# EAGLE design RH008.1 (EAGLE 7.1.0)
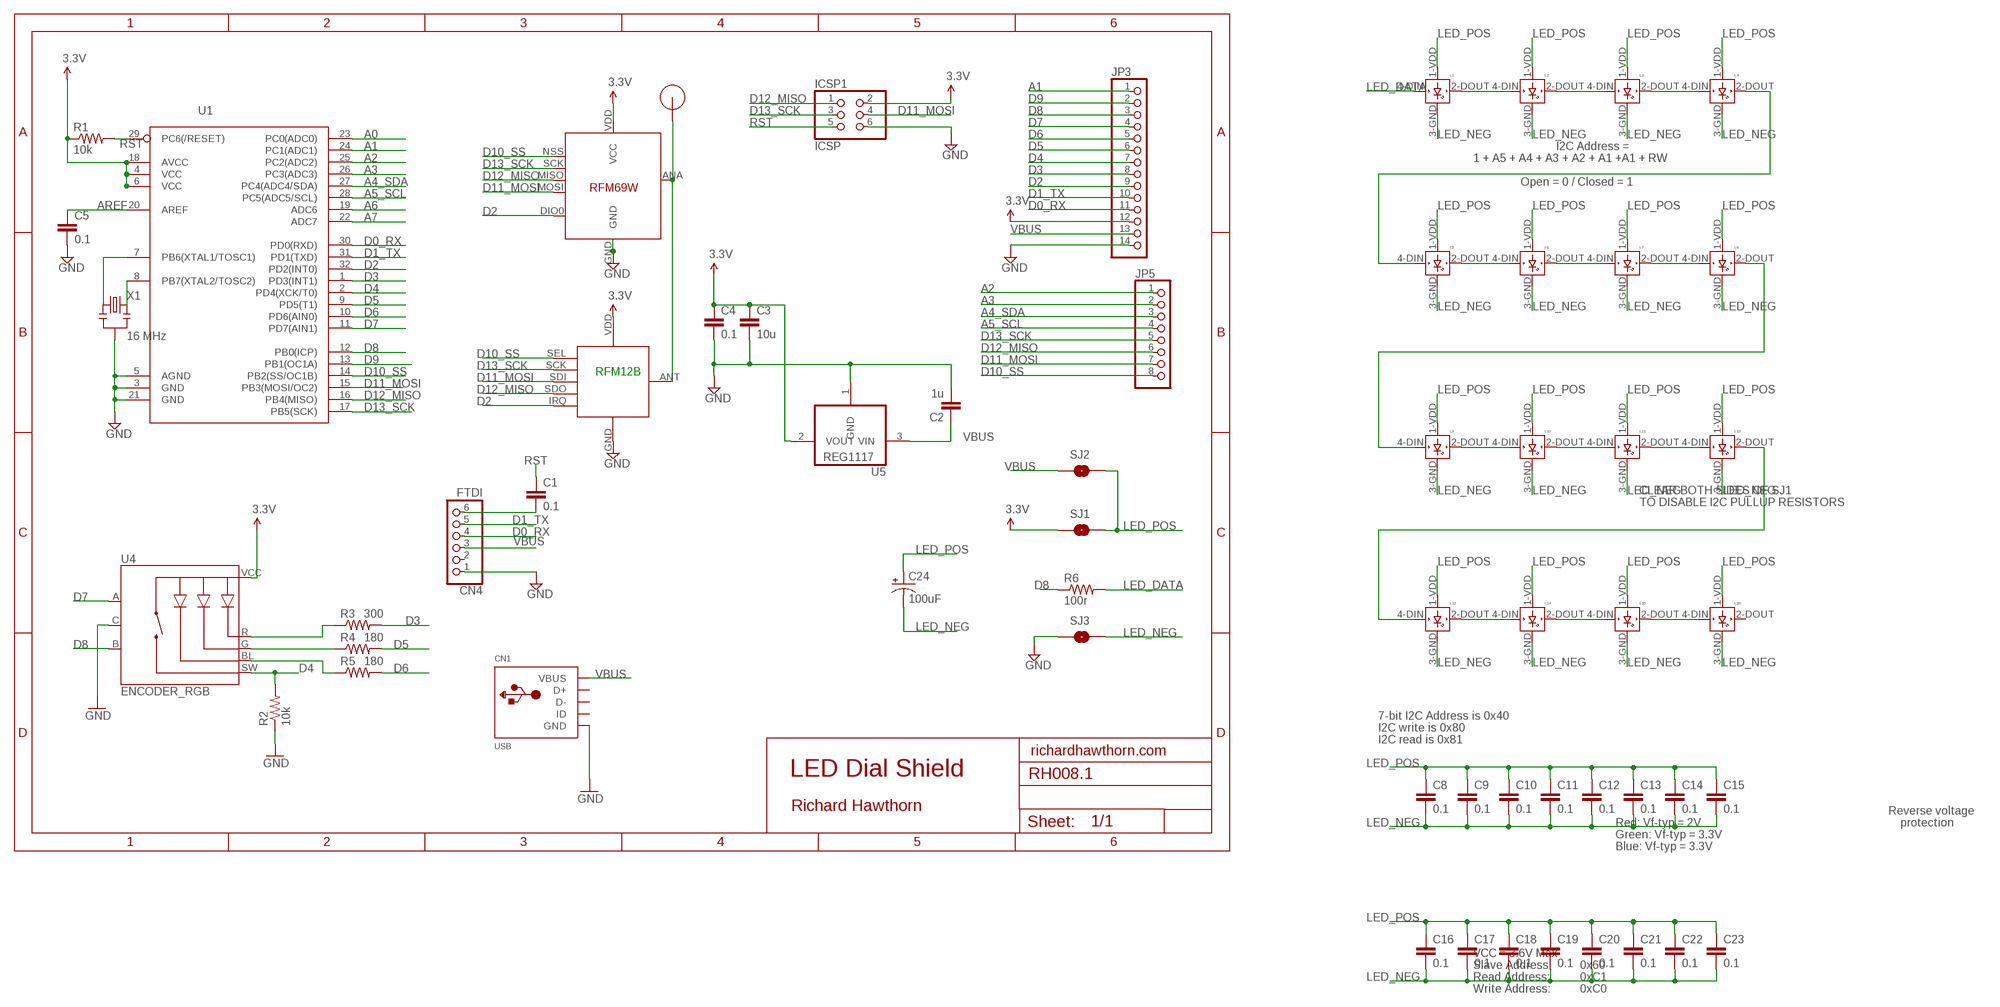
[diagram p0: schematic, sheet 1]

## Parts
C1  0.1  CAP0603-CAP  [0603-CAP]
C2  1u  CAP0603-CAP  [0603-CAP]
C3  10u  CAP0805-CAP  [0805-CAP]
C4  0.1  CAP0603-CAP  [0603-CAP]
C5  0.1  CAP0603-CAP  [0603-CAP]
C8  0.1  CAP0603-CAP  [0603-CAP]
C9  0.1  CAP0603-CAP  [0603-CAP]
C10  0.1  CAP0603-CAP  [0603-CAP]
C11  0.1  CAP0603-CAP  [0603-CAP]
C12  0.1  CAP0603-CAP  [0603-CAP]
C13  0.1  CAP0603-CAP  [0603-CAP]
C14  0.1  CAP0603-CAP  [0603-CAP]
C15  0.1  CAP0603-CAP  [0603-CAP]
C16  0.1  CAP0603-CAP  [0603-CAP]
C17  0.1  CAP0603-CAP  [0603-CAP]
C18  0.1  CAP0603-CAP  [0603-CAP]
C19  0.1  CAP0603-CAP  [0603-CAP]
C20  0.1  CAP0603-CAP  [0603-CAP]
C21  0.1  CAP0603-CAP  [0603-CAP]
C22  0.1  CAP0603-CAP  [0603-CAP]
C23  0.1  CAP0603-CAP  [0603-CAP]
C24  100uF  100UF-10V-10%(TANT)  [EIA7343]
CN1  USB  USBMINIB  [USB-MINIB]
CN4  FTDI  PINHD-1X6  [1X06]
ICSP1  ICSP  PINHD-2X3  [2X03]
JP3  PINHD-1X14  [1X14]
JP5  PINHD-1X8  [1X08]
L1  WS2812B  [WS2812B]
L2  WS2812B  [WS2812B]
L3  WS2812B  [WS2812B]
L4  WS2812B  [WS2812B]
L5  WS2812B  [WS2812B]
L6  WS2812B  [WS2812B]
L7  WS2812B  [WS2812B]
L8  WS2812B  [WS2812B]
L9  WS2812B  [WS2812B]
L10  WS2812B  [WS2812B]
L11  WS2812B  [WS2812B]
L12  WS2812B  [WS2812B]
L13  WS2812B  [WS2812B]
L14  WS2812B  [WS2812B]
L15  WS2812B  [WS2812B]
L16  WS2812B  [WS2812B]
R1  10k  R-US_R0805  [R0805]
R2  10k  R-US_R0805  [R0805]
R3  300  R-US_R0805  [R0805]
R4  180  R-US_R0805  [R0805]
R5  180  R-US_R0805  [R0805]
R6  100r  R-US_R0805  [R0805]
RF1  RFM12B  RFM12B_MINPADS  [RFM12B-MINPADS]
RF2  RFM69  [RFM69W-MINPADS]
SJ1  SOLDERJUMPERNO  [SJ_2S-NO]
SJ2  SOLDERJUMPERNO  [SJ_2S-NO]
SJ3  SOLDERJUMPERNO  [SJ_2S-NO]
U1  ATMega-328  ATMEGA168/328TQFP32  [TQFP32-08]
U4  ENCODER_RGB  [ENCODER_LED_RGB]
U5  REG1117  [SOT223]
U$1  RFM12B_ANTENNA  [RFM12B-ANTENNA]
X1  16 MHz  RESONATORSMD  [RESONATOR-SMD]

## Nets
3.3V: JP3.12
A0: U1.23(PC0(ADC0))
A1: JP3.1 U1.24(PC1(ADC1))
A2: JP5.1 U1.25(PC2(ADC2))
A3: JP5.2 U1.26(PC3(ADC3))
A4_SDA: JP5.3 U1.27(PC4(ADC4/SDA))
A5_SCL: JP5.4 U1.28(PC5(ADC5/SCL))
A6: U1.19(ADC6)
A7: U1.22(ADC7)
AREF: C5.1 U1.20(AREF)
D0_RX: CN4.4 JP3.11 U1.30(PD0(RXD))
D1_TX: CN4.5 JP3.10 U1.31(PD1(TXD))
D2: JP3.9 RF1.IRQ RF2.DIO0 U1.32(PD2(INT0))
D3: JP3.8 R3.2 U1.1(PD3(INT1))
D4: JP3.7 R2.2 U1.2(PD4(XCK/T0)) U4.SW
D5: JP3.6 R4.2 U1.9(PD5(T1))
D6: JP3.5 R5.2 U1.10(PD6(AIN0))
D7: JP3.4 U1.11(PD7(AIN1)) U4.A
D8: JP3.3 R6.1 U1.12(PB0(ICP)) U4.B
D9: JP3.2 U1.13(PB1(OC1A))
D10_SS: JP5.8 RF1.SEL RF2.NSS(SEL) U1.14(PB2(SS/OC1B))
D11_MOSI: ICSP1.4 JP5.7 RF1.SDI(SDI/MOSI) RF2.MOSI U1.15(PB3(MOSI/OC2))
D12_MISO: ICSP1.1 JP5.6 RF1.SDO(SDO/MISO) RF2.MISO U1.16(PB4(MISO))
D13_SCK: ICSP1.3 JP5.5 RF1.SCK RF2.SCK U1.17(PB5(SCK))
GND [power]: C2.2 C3.2 C4.2 C5.2 CN1.GND CN4.1 ICSP1.6 JP3.14 R2.1 RF1.GND RF2.GND SJ3.1 U1.3(GND) U1.5(AGND) U1.21(GND) U4.C U5.1(GND) X1.2
LED-B: R5.1 U4.BL
LED-G: R4.1 U4.G
LED-MID-1: L5.2-DOUT(DOUT) L6.4-DIN(DIN)
LED-MID-2: L7.2-DOUT(DOUT) L8.4-DIN(DIN)
LED-MID-3: L9.2-DOUT(DOUT) L10.4-DIN(DIN)
LED-OUT-1: L1.2-DOUT(DOUT) L2.4-DIN(DIN)
LED-OUT-2: L3.2-DOUT(DOUT) L4.4-DIN(DIN)
LED-OUT-3: L4.2-DOUT(DOUT) L5.4-DIN(DIN)
LED-OUT-4: L12.2-DOUT(DOUT) L13.4-DIN(DIN)
LED-OUT-5: L13.2-DOUT(DOUT) L14.4-DIN(DIN)
LED-OUT-6: L15.2-DOUT(DOUT) L16.4-DIN(DIN)
LED-R: R3.1 U4.R
LED_DATA: L1.4-DIN(DIN) R6.2
LED_NEG [power]: C8.2 C9.2 C10.2 C11.2 C12.2 C13.2 C14.2 C15.2 C16.2 C17.2 C18.2 C19.2 C20.2 C21.2 C22.2 C23.2 C24.C(-) L1.3-GND(GND) L2.3-GND(GND) L3.3-GND(GND) L4.3-GND(GND) L5.3-GND(GND) L6.3-GND(GND) L7.3-GND(GND) L8.3-GND(GND) L9.3-GND(GND) L10.3-GND(GND) L11.3-GND(GND) L12.3-GND(GND) L13.3-GND(GND) L14.3-GND(GND) L15.3-GND(GND) L16.3-GND(GND) SJ3.2
LED_POS [power]: C8.1 C9.1 C10.1 C11.1 C12.1 C13.1 C14.1 C15.1 C16.1 C17.1 C18.1 C19.1 C20.1 C21.1 C22.1 C23.1 C24.A(+) L1.1-VDD(VDD) L2.1-VDD(VDD) L3.1-VDD(VDD) L4.1-VDD(VDD) L5.1-VDD(VDD) L6.1-VDD(VDD) L7.1-VDD(VDD) L8.1-VDD(VDD) L9.1-VDD(VDD) L10.1-VDD(VDD) L11.1-VDD(VDD) L12.1-VDD(VDD) L13.1-VDD(VDD) L14.1-VDD(VDD) L15.1-VDD(VDD) L16.1-VDD(VDD) SJ1.2 SJ2.2
N$1: L2.2-DOUT(DOUT) L3.4-DIN(DIN)
N$2: L6.2-DOUT(DOUT) L7.4-DIN(DIN)
N$3: L8.2-DOUT(DOUT) L9.4-DIN(DIN)
N$4: L10.2-DOUT(DOUT) L11.4-DIN(DIN)
N$5: L11.2-DOUT(DOUT) L12.4-DIN(DIN)
N$6: U1.7(PB6(XTAL1/TOSC1)) X1.1
N$8: RF1.ANT RF2.ANA(ANT) U$1.P$1
N$18: L14.2-DOUT(DOUT) L15.4-DIN(DIN)
N$20: C1.2 CN4.6
N$21: U1.8(PB7(XTAL2/TOSC2)) X1.3
RST: C1.1 ICSP1.5 R1.2 U1.29(PC6(/RESET))
VBUS [power]: C2.1 CN1.VBUS CN4.3 JP3.13 SJ2.1 U5.3(VIN)
VCC: C3.1 C4.1 ICSP1.2 R1.1 RF1.VDD RF2.VDD(VCC) SJ1.1 U1.4(VCC) U1.6(VCC) U1.18(AVCC) U4.VCC U5.2(VOUT) ; supply symbol labelled 3.3V
Unconnected: CN1.D+ CN1.D- CN1.ID CN4.2 L16.2-DOUT(DOUT)

## Notes on the sheet
- I2C Address =
- 1 + A5 + A4 + A3 + A2 + A1 +A1 + RW
- Open = 0 / Closed = 1
- RFM12B
- CLEAR BOTH SIDES OF SJ1
- TO DISABLE I2C PULLUP RESISTORS
- 7-bit I2C Address is 0x40
- I2C write is 0x80
- I2C read is 0x81
- richardhawthorn.com
- LED Dial Shield
- Richard Hawthorn
- Reverse voltage
- Red: Vf-typ = 2V | protection
- Green: Vf-typ = 3.3V
- Blue: Vf-typ = 3.3V
- VCC = 3.6V Max
- Slave Address: | 0x60
- Read Address: | 0xC1
- Write Address: | 0xC0

## Library data of the parts
C1-C5 C8-C23 = LowPowerLab:CAP: Capacitor Standard 0603 ceramic capacitor, and 0.1" leaded capacitor.
C24 = SparkFun-Capacitors:100UF-10V-10%(TANT): CAP-07890; PROD_ID: CAP-07890
CN1 = LowPowerLab:USB: USB Connectors USBMINIB - Surface Mount Female Mini-B USB Connector 4UConnector: 06564 By microbuilder.eu Thru-hole RA Female Mini-B USB Connector 4UConnector: 18732 By ladyada.net
CN4 = pinhead:PINHD-1X6: PIN HEADER
ICSP1 = pinhead:PINHD-2X3: PIN HEADER
JP3 = pinhead:PINHD-1X14: PIN HEADER
JP5 = pinhead:PINHD-1X8: PIN HEADER
L1-L16 = adafruit:WS2812B
R1-R6 = resistor:R-US_: RESISTOR, American symbol
RF1 = LowPowerLab:RFM12B_MINPADS
RF2 = LowPowerLab:RFM69
SJ1-SJ3 = SparkFun-Retired:SOLDERJUMPER: Solder Jumper Standard SMD solder jumper. Used to automate production. Two varients : Normally Open and Normally Closed are the same, but have different paste layers. NC will have a large amount of paste and should jumper during reflow.
U1 = LowPowerLab:ATMEGA168/328: Atmel 32-pin 8-bit micro, 16k flash.
U4 = SparkFun:ENCODER_RGB: Illuminated Rotary Encoder w/ RGB LED and select switch EC12PLRGBSDVBF-D: http://top-up.so-buy.com/front/bin/ptdetail.phtml?Part=EC12PLRGBSDVBF-D
U5 = burr-brown:REG1117: 800mA and 1A Low Dropout (LDO) Positive Regulator 1.8V, 2.5V, 2.85V, 3.3V, 5V, and Adj; MPN: REG1117; OC_FARNELL: 1097566; OC_NEWARK: 14P6981
U$1 = LowPowerLab:RFM12B_ANTENNA
X1 = SparkFun:RESONATOR: Resonator Small SMD resonator. This is the itty bitty 10/20MHz resonators with built in caps. CSTCE10M0G55 and CSTCE20M0V53. Footprint has been reviewed closely but hasn't been tested yet.

## Net classes
1 power: width 0.381 mm, clearance 0.254 mm

## Board
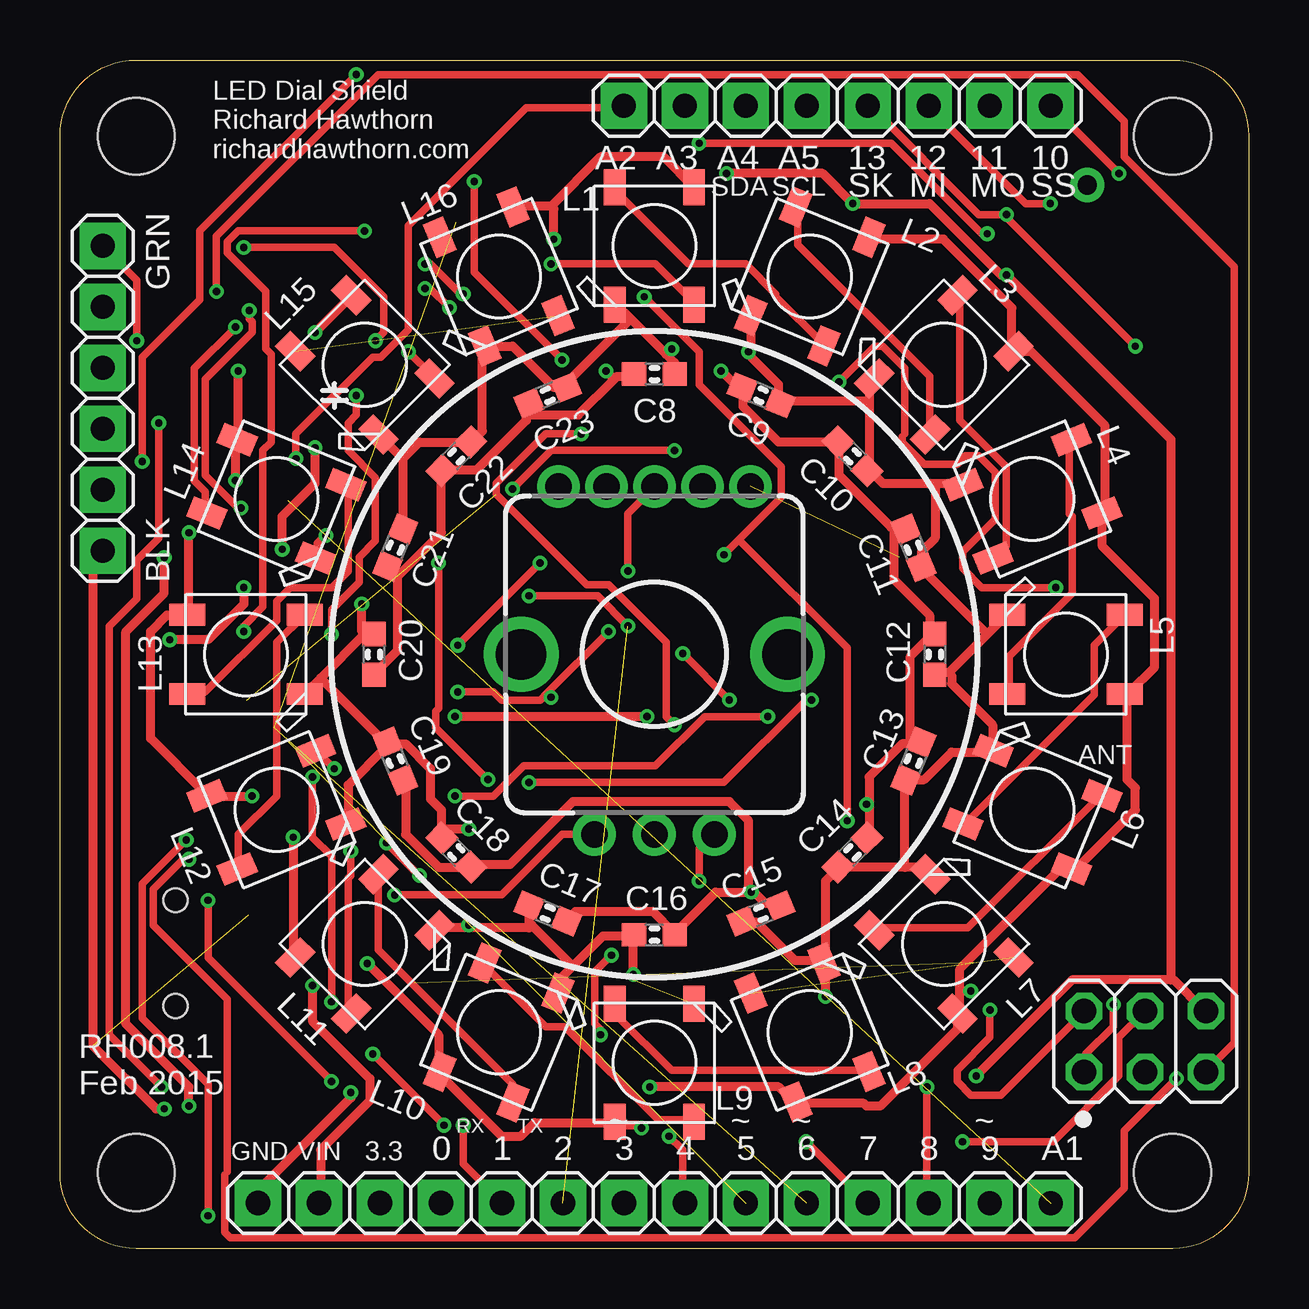
[diagram p1: board, top side]
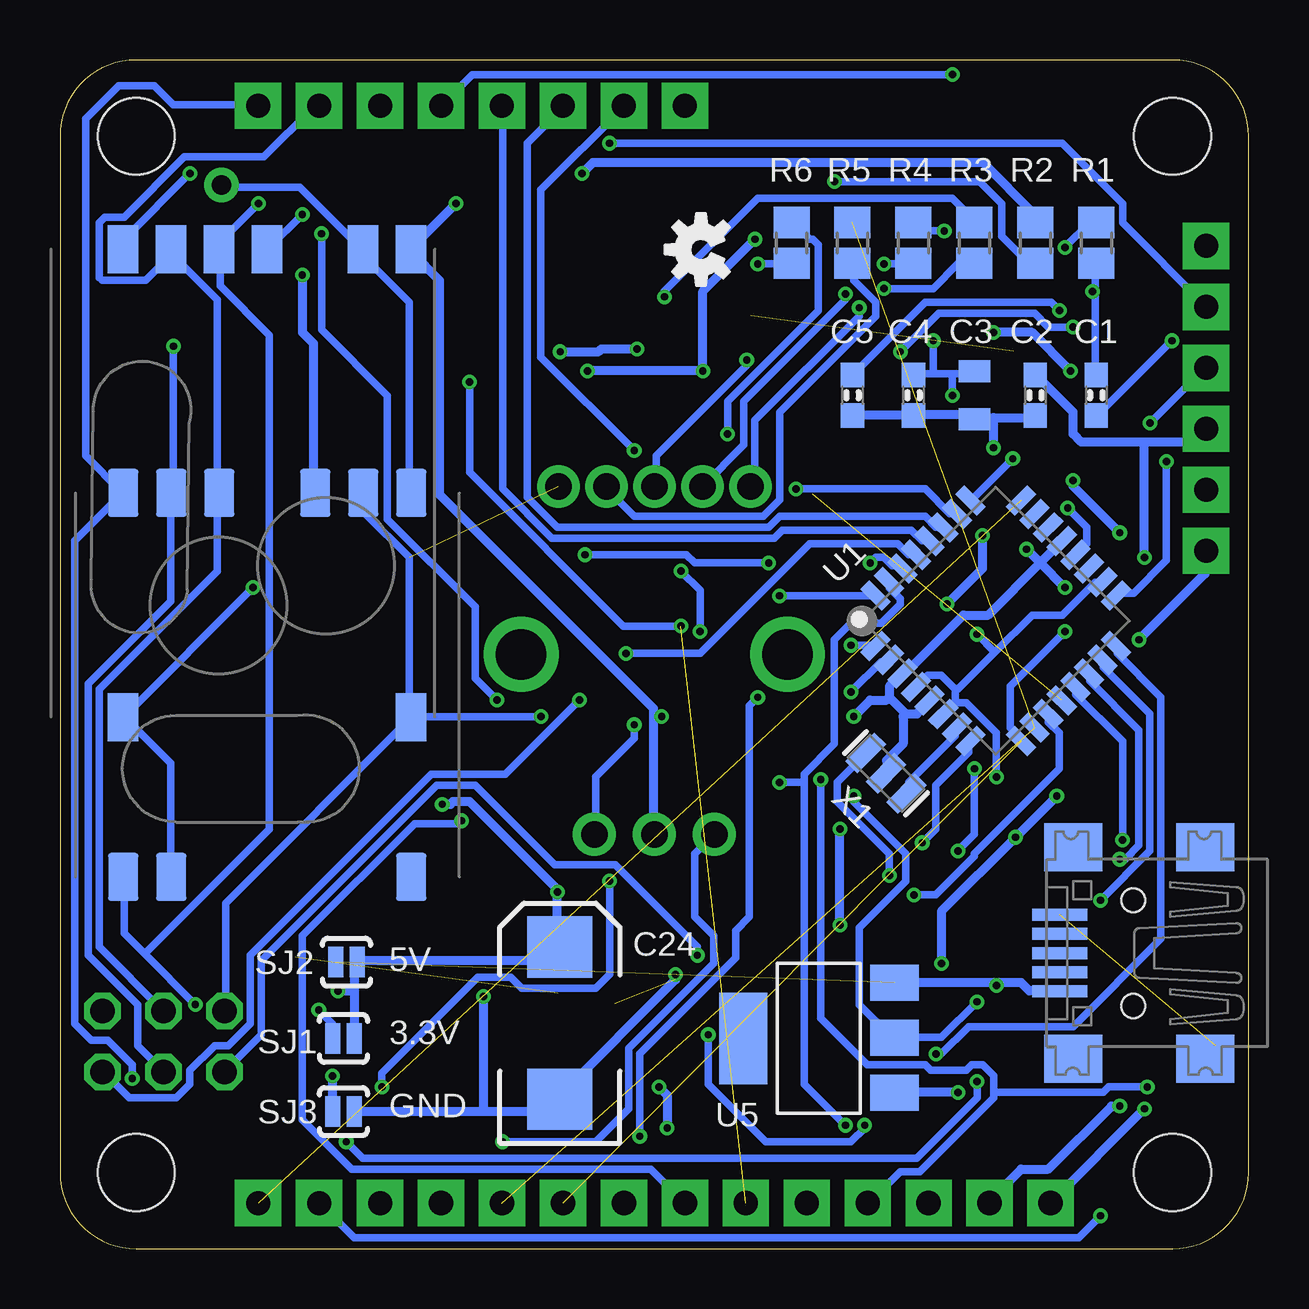
[diagram p2: board, bottom side, seen from below]

Size 49.53 x 49.53 mm. Coordinates in mm from the lower left corner, seen from the top.
Outline: 0,3.17 0,46.35 arc-90 3.17,49.53 46.35,49.53 arc-90 49.53,46.35 49.53,3.17 arc-90 46.35,0 3.17,0 arc-90 0,3.17
Copper layers (1*16): Top 0.035mm / dielectric 1.5mm / Bottom 0.035mm
Design rules "ITEADstudio_DRC *": minimum track width 12mil, minimum drill 12mil, track to track 6mil, track to pad 6mil, pad to pad 6mil, via to via 6mil, smd to smd 0mil, copper to edge 10mil, drill to drill 10mil, minimum pad ring 10mil, minimum via ring 6mil, stop-mask expansion 2mil, vias tented up to drill 100mil, thermal gap 15mil
Holes 3.2 mm at 3.17,3.17 46.35,3.17 3.17,46.35 46.35,46.35
tKeepout: area 0,0 to 5.7,5.7; area 43.8,0 to 49.5,5.7; area 43.8,43.8 to 49.5,49.5; area 0,43.8 to 5.7,49.5
bKeepout: area 0,43.8 to 5.7,49.5; area 43.8,43.8 to 49.5,49.5; area 43.8,0 to 49.5,5.7; area 0,0 to 5.7,5.7
tRestrict: area 24.3,8.9 to 29.1,12.8; area 5.8,16.9 to 6.9,18.5; area 5.2,9.7 to 6.7,10.4
bRestrict: area 27.4,17.7 to 29.2,18.7; area 21.1,13.8 to 22.9,14.9; area 21.6,12.6 to 22.1,13.2; area 20.7,12.6 to 21.2,13.2; area 20.2,12.8 to 20.7,13.5; area 20.1,13.4 to 20.6,14; area 26.5,18.9 to 27.1,19.5; area 26.5,17.9 to 27.1,18.5; area 27.5,19.1 to 28,19.8; area 27.9,18.8 to 29.1,19.6

### Footprints (pad centres in the part's own frame; a part is rotated, then mirrored left to right if it is on the bottom)
0603-CAP = smd 1.016 x 0.965: 1 -0.85,0; 2 0.85,0
0805-CAP = smd 0.902 x 1.3: 1 -1,0; 2 1,0
EIA7343 = smd 2.55 x 2.7: A 3.17,0; C -3.17,0
USB-MINIB = smd 0.5 x 2.308: D+ 0,4.064; D- -0.8,4.064; GND 1.6,4.064; ID 0.8,4.064; VBUS -1.6,4.064 | smd 2 x 2.4: GND1 -4.4,-2; GND2 -4.4,3.5; GND3 4.4,3.5; GND4 4.4,-2 | hole 1: -2.2,1; 2.2,1
1X06 = drill 1 pad 1.93 square: 1 -6.35,0; 2 -3.81,0; 3 -1.27,0; 4 1.27,0; 5 3.81,0; 6 6.35,0
2X03 = drill 1.016 octagon: 1 -2.54,-1.27; 2 -2.54,1.27; 3 0,-1.27; 4 0,1.27; 5 2.54,-1.27; 6 2.54,1.27
1X14 = drill 1 pad 1.93 square: 1 -16.51,0; 2 -13.97,0; 3 -11.43,0 | drill 1.016 pad 1.93 square: 4 -8.89,0; 5 -6.35,0; 6 -3.81,0; 7 -1.27,0; 8 1.27,0; 9 3.81,0; 10 6.35,0; 11 8.89,0; 12 11.43,0; 13 13.97,0; 14 16.51,0
1X08 = drill 1 pad 1.93 square: 1 -8.89,0; 2 -6.35,0; 3 -3.81,0; 4 -1.27,0; 5 1.27,0; 6 3.81,0; 7 6.35,0; 8 8.89,0
WS2812B = smd 1.5 x 0.9: 1-VDD 2.45,-1.65; 2-DOUT 2.45,1.65; 3-GND -2.45,1.65; 4-DIN -2.45,-1.65
R0805 = smd 1.3 x 1.5: 1 -0.85,0; 2 0.85,0
RFM12B-MINPADS = smd 2 x 1.27: ANT 8,-6; GND 8,-2; IRQ -8,4; SCK 8,4; SDI 8,2; SDI1 -8.002,-6.001; SDO -8,6; SEL 8,6; VDD 8,-4
RFM69W-MINPADS = smd 2 x 1.27: ANA 8,-5; DIO0 -11.5,5; GND 8,-7; MISO 8,1; MOSI 8,3; NSS 8,5; SCK 8,-1; VDD -11.5,-7
SJ_2S-NO = smd 0.635 x 1.27: 1 -0.45,0; 2 0.45,0
TQFP32-08 = smd 1.27 x 0.533: 1 -4.293,2.8; 2 -4.293,2; 3 -4.293,1.2; 4 -4.293,0.4; 5 -4.293,-0.4; 6 -4.293,-1.2; 7 -4.293,-2; 8 -4.293,-2.8; 17 4.293,-2.8; 18 4.293,-2; 19 4.293,-1.2; 20 4.293,-0.4; 21 4.293,0.4; 22 4.293,1.2; 23 4.293,2; 24 4.293,2.8 | smd 0.533 x 1.27: 9 -2.8,-4.293; 10 -2,-4.293; 11 -1.2,-4.293; 12 -0.4,-4.293; 13 0.4,-4.293; 14 1.2,-4.293; 15 2,-4.293; 16 2.8,-4.293; 25 2.8,4.293; 26 2,4.293; 27 1.2,4.293; 28 0.4,4.293; 29 -0.4,4.293; 30 -1.2,4.293; 31 -2,4.293; 32 -2.8,4.293
ENCODER_LED_RGB = drill 1.1 pad 1.8: A -2.5,-7.5; B 2.5,-7.5; C 0,-7.5 | drill 1.1 pad 1.778: BL 2,7; G -2,7; R -4,7; SW 0,7; VCC 4,7 | drill 2.1: P$1 -5.55,0; P$2 5.55,0
SOT223 = smd 1.499 x 2.007: 1 -2.261,-3.15; 2 0.025,-3.15; 3 2.311,-3.15 | smd 3.81 x 2.007: 4 0,3.15
RFM12B-ANTENNA = drill 0.8 pad 1.422: P$1 0,0
RESONATOR-SMD = smd 0.7 x 1.7: 1 -1.2,0; 2 0,0; 3 1.2,0

### Placement (x,y rotation side)
C1  6.35,35.56 270 bottom
C2  8.89,35.56 270 bottom
C3  11.43,35.56 270 bottom
C4  13.97,35.56 270 bottom
C5  16.51,35.56 270 bottom
C8  24.77,36.45 0 top
C9  29.21,35.56 337.5 top
C10  33.02,33.02 315 top
C11  35.56,29.21 292.5 top
C12  36.45,24.77 270 top
C13  35.56,20.32 247.5 top
C14  33.02,16.51 225 top
C15  29.21,13.97 202.5 top
C16  24.77,13.08 180 top
C17  20.32,13.97 157.5 top
C18  16.51,16.51 135 top
C19  13.97,20.32 112.5 top
C20  13.08,24.77 90 top
C21  13.97,29.21 67.5 top
C22  16.51,33.02 45 top
C23  20.32,35.56 22.5 top
C24  28.7,9.4 90 bottom
CN1  3.81,12.32 90 bottom
CN4  1.78,35.43 90 top
ICSP1  45.21,8.64 0 top
JP3  24.77,1.91 180 top
JP5  32.38,47.62 0 top
L1  24.77,41.78 90 top
L2  31.24,40.51 67.5 top
L3  36.83,36.83 45 top
L4  40.51,31.24 22.5 top
L5  41.91,24.77 0 top
L6  40.51,18.29 337.5 top
L7  36.83,12.7 315 top
L8  31.24,9.02 292.5 top
L9  24.77,7.75 270 top
L10  18.29,9.02 247.5 top
L11  12.7,12.7 225 top
L12  9.02,18.29 202.5 top
L13  7.75,24.77 180 top
L14  9.02,31.24 157.5 top
L15  12.7,36.83 135 top
L16  18.29,40.51 112.5 top
R1  6.35,41.91 270 bottom
R2  8.89,41.91 270 bottom
R3  11.43,41.91 90 bottom
R4  13.97,41.91 90 bottom
R5  16.51,41.91 90 bottom
R6  19.05,41.91 270 bottom
RF1  40.89,23.5 90 bottom
RF2  41.91,33.66 90 bottom
SJ1  37.72,8.76 0 bottom
SJ2  37.59,11.94 0 bottom
SJ3  37.72,5.71 0 bottom
U1  10.54,26.16 45 bottom
U4  24.77,24.77 0 top
U5  17.91,8.76 90 bottom
U$1  42.8,44.32 0 top
U$3  [OSHW-LOGO-S]  22.82,41.63 90 bottom
X1  15.11,19.81 135 bottom

### Tracks (layer width: path | path; a pad name or v marks a point on that pad's centre or on a via)
A1  (1 unrouted)
A2  (via drill 0.3)
  Top 0.305: v9.83,32.92 9.83,33.95 13.03,37.15 13.37,37.15 14.52,38.29 14.52,42.63 19.43,47.55 23.43,47.55 JP5.1
  Bottom 0.305: v9.83,32.92 11.54,31.2 U1.25
A3  (via drill 0.3)
  Top 0.305: v18.86,31.66 20.46,33.26 v25.6,33.26
  Bottom 0.305: v18.86,31.66 13.49,31.66 12.46,30.63 12.23,30.63 U1.26 | v25.6,33.26 29.49,37.15 29.49,44.12 26.06,47.55 JP5.2
A4_SDA
  Bottom 0.305: U1.27 12.8,30.06 13.03,30.06 13.49,30.52 19.55,30.52 20,30.06 28.8,30.06 30.06,31.32 30.06,46.06 28.57,47.55 JP5.3
A5_SCL
  Bottom 0.305: U1.28 13.37,29.49 13.6,29.49 14.06,29.95 19.43,29.95 19.77,29.6 29.03,29.6 31.09,31.66 31.09,47.55 JP5.4
AREF  (via drill 0.3)
  Top 0.305: v7.89,39.09 7.89,38.75 8,38.63 8,38.18 6.06,36.23 6.06,32.23 7.43,30.86 v7.54,30.86
  Bottom 0.305: v7.89,39.09 8.23,39.43 13.49,39.43 16.46,36.46 C5.1 | v7.54,30.86 6.74,30.06 6.74,29.38 7.2,28.92 U1.20
D0_RX  (via drill 0.3)
  Top 0.305: v15.77,28.57 15.77,22.52 15.66,22.4 15.66,21.72 v17.83,19.55 | v4.12,34.4 4.12,29.6 3.2,28.69 3.2,27.09 2.06,25.95 2.06,8.91 v4.23,6.74
  Bottom 0.305: v15.77,28.57 15.54,28.8 15.2,28.8 14.86,28.46 14.52,28.46 U1.30 | v17.83,19.55 17.83,9.6 15.89,7.66 13.49,7.66 13.26,7.43 11.77,7.43 11.54,7.66 11.09,7.66 10.63,7.2 10.63,6.51 | 10.63,6.51 10.63,6.29 13.72,3.2 14.52,3.2 15.77,1.94 JP3.11 | v4.12,34.4 1.83,36.69 CN4.4 | v4.23,6.74 5.83,6.74 6.06,6.51 10.63,6.51
D1_TX  (via drill 0.3)
  Top 0.305: v16.8,5.14 16.8,3.54 18.4,1.94 JP3.10 | v26.63,46.06 34.63,46.06 38.41,42.29 v38.63,42.29 | v31.32,22.86 31.09,22.86 27.66,19.43 v19.55,19.43
  Bottom 0.305: 18.52,19.43 18.52,6.86 v16.8,5.14 | 18.52,19.43 18.52,19.77 17.26,21.03 17.26,25.38 16.57,26.06 15.32,26.06 14.52,26.86 14.52,27.09 14.97,27.55 14.97,27.77 U1.31 | v26.63,46.06 7.77,46.06 5.26,43.55 5.26,42.75 1.83,39.32 CN4.5 | v38.63,42.29 38.63,38.29 35.89,35.55 35.89,30.4 32.23,26.75 32.23,23.77 v31.32,22.86 | 18.52,19.43 v19.55,19.43
D2  (via drill 0.3)  (1 unrouted)
  Top 0.305: v19.55,27.2 22.4,27.2 v23.66,25.95 | v32.46,36.12 33.95,37.6 34.29,37.6 35.2,36.69 35.2,33.95 35.09,33.83 35.09,33.6 36.01,32.69 37.38,32.69 37.72,33.03 38.29,33.03 38.98,32.35 38.98,30.4 37.6,29.03 37.6,28.35 38.41,27.55 v41.49,27.55
  Bottom 0.305: v19.55,27.2 15.66,27.2 U1.32 | v23.66,25.95 26.06,25.95 32.46,32.35 v32.46,36.12 | v41.49,27.55 46.86,22.17 RF2.DIO0 46.75,22.06 44.92,20.23 44.92,15.54 RF1.IRQ
D3  (via drill 0.3)
  Top 0.305: v20,28.57 v16.57,25.15 | 28.29,29.55 30.06,31.32 30.06,32.58 26.63,36.01 26.63,37.38 v24.35,39.66 | 28.29,29.55 v27.66,28.92 | v32.8,17.83 32.8,25.03 28.29,29.55
  Bottom 0.305: v16.57,25.15 15.66,25.15 U1.1 | v20,28.57 23.09,28.57 23.43,28.92 v27.66,28.92 | v24.35,39.66 24.35,39.89 20.46,43.78 12.34,43.78 11.43,42.86 R3.2 | v32.8,17.83 32.92,17.72 34.75,17.72 39.43,13.03 39.43,5.37 37.38,3.31 24.92,3.31 23.55,1.94 JP3.8
D4  (via drill 0.3)
  Top 0.305: v16.57,23.2 18.06,23.2 18.4,22.86 20,22.86 20.29,23.15 | v22.86,25.72 20.29,23.15 | v23.66,28.23 23.66,30.63 24.69,31.66 U4.SW | v17.26,44.46 17.26,40.69 v20.92,37.03 | v25.38,4.69 25.95,4.12 25.95,1.94 JP3.7 | 20.29,23.15 v20.46,22.97
  Bottom 0.305: v16.57,23.2 15.32,24.46 15.09,24.46 U1.2 | v22.86,25.72 22.86,27.43 v23.66,28.23 | v17.26,44.46 11.2,44.46 10.29,43.55 10.29,42.18 9.26,41.15 8.91,41.15 R2.2 | v20.92,37.03 20.92,36.8 24.69,33.03 24.69,31.77 U4.SW | v25.38,4.69 25.38,8.12 21.37,12.12 21.37,13.26 20.8,13.83 20.8,22.63 v20.46,22.97
D5  (via drill 0.3)  (1 unrouted)
  Top 0.305: v7.66,25.72 7.66,25.95 8.46,26.75 8.46,33.26 8.8,33.6 8.8,37.26 8.57,37.49 8.57,39.89 6.97,41.49 6.97,41.95 7.43,42.41 v12.69,42.41
  Bottom 0.305: v7.66,25.72 9.94,23.43 9.94,21.72 9.49,21.26 U1.9 | v12.69,42.41 13.6,42.41 13.95,42.75 R4.2
D6  (2 unrouted)
D7  (via drill 0.3)
  Top 0.305: v13.95,14.74 18.4,14.74 20.92,17.26 22.17,17.26 U4.A | v31.09,4.46 33.6,1.94 JP3.4
  Bottom 0.305: v13.95,14.74 13.03,14.74 11.43,16.34 11.43,16.46 7.89,20 7.89,21.49 8.34,21.95 8.34,22.17 U1.11 | v31.09,4.46 27.2,4.46 25.83,5.83 25.83,8.34 22.29,11.89 22.29,13.03 23.09,13.83 23.09,16.46 22.29,17.26 U4.A
D8  (via drill 0.3)  (1 unrouted)
  Top 0.305: v21.72,33.95 20.23,33.95 18.17,31.89 18.17,31.43 21.95,27.66 22.86,27.66 25.26,25.26 25.26,22.17 v25.6,21.83 | v36.12,6.74 36.12,1.94 JP3.3 | v26.63,15.32 26.63,16.69 27.2,17.26 U4.B
  Bottom 0.305: v21.72,33.95 21.72,35.32 17.95,39.09 17.95,41.83 18.17,42.06 18.29,42.06 18.97,42.75 R6.1 | v25.6,21.83 25.6,21.26 27.2,19.66 27.2,17.37 U4.B | v36.12,6.74 36.12,7.32 32.12,11.32 30.75,11.32 30.29,10.86 27.2,10.86 26.63,11.43 v26.63,15.32
D9  (via drill 0.3)
  Top 0.305: v5.26,17.03 3.43,15.2 3.43,9.6 6.17,6.86 v6.17,1.37
  Bottom 0.305: v5.26,17.03 5.26,21.14 7.2,23.09 7.2,23.32 U1.13 | v6.17,1.37 7.09,0.46 37.26,0.46 38.63,1.83 JP3.2
D10_SS  (via drill 0.3)
  Top 0.305: v44.12,44.81 41.38,47.55 JP5.8 | v5.37,16.23 5.14,16.23 3.89,14.97 3.89,13.49 6.97,10.4 6.97,3.2 6.86,3.09 6.86,0.69 7.09,0.46 42.29,0.46 44.35,2.52 44.35,4.92 v46.52,7.09
  Bottom 0.305: v44.12,44.81 46.86,42.06 46.86,41.72 RF2.NSS | v5.37,16.23 5.14,16.23 4.57,16.8 4.57,21.6 6.63,23.66 6.63,23.89 U1.14 | v46.52,7.09 46.52,7.66 47.55,8.69 48.23,8.69 48.92,9.37 48.92,29.49 46.98,31.43 RF1.SEL 46.98,31.55 48.46,33.03 48.46,47.09 47.09,48.46 45.61,48.46 44.81,47.66 41.38,47.66 JP5.8
D11_MOSI  (via drill 0.3)
  Top 0.305: v6.17,14.52 6.17,12.12 v11.32,6.97 | v37.6,4.46 41.38,4.46 44.12,7.2 44.12,8.8 45.15,9.83 ICSP1.4
  Bottom 0.305: JP5.7 38.75,47.55 38.98,47.55 41.03,45.49 44.35,45.49 46.86,42.98 47.66,42.98 47.89,42.75 47.89,40.46 47.78,40.35 45.95,40.35 44.92,41.38 RF2.MOSI 44.81,41.6 44.81,41.38 42.98,39.55 42.98,31.55 RF1.SDI 42.98,31.43 42.98,28.23 47.89,23.32 47.89,12.57 45.26,9.94 ICSP1.4 | v6.17,14.52 4.12,16.57 4.12,22.29 6.06,24.23 6.06,24.46 U1.15 | v11.32,6.97 11.32,6.29 13.83,3.77 36.92,3.77 v37.6,4.46
D12_MISO  (via drill 0.3)
  Top 0.305: v41.26,43.55 40.23,43.55 36.23,47.55 JP5.6 | v16,5.14 v13.03,8.12 | v22.52,8.91 22.52,9.14 22.29,9.37 22.29,11.54 v22.97,12.23 | v43.89,10.17 43.89,9.26 42.75,8.12 42.75,7.43 ICSP1.1
  Bottom 0.305: v41.26,43.55 42.86,41.95 42.86,41.72 RF2.MISO 42.86,41.6 42.86,40.12 40.8,38.06 40.8,17.49 46.01,12.29 | v13.03,8.12 12.8,8.12 11.66,9.26 7.32,9.26 3.66,12.92 3.66,22.97 5.49,24.8 5.49,25.03 U1.16 | v16,5.14 16,5.03 16.57,4.46 20.12,4.46 22.52,6.86 v22.52,8.91 | v22.97,12.23 22.97,12.57 26.4,16 28.92,16 32.23,19.32 33.83,19.32 41.15,12 41.15,8.91 42.63,7.43 ICSP1.1 | v43.89,10.17 46.01,12.29 | 46.01,12.29 46.86,13.14 46.86,15.43 RF1.SDO
D13_SCK  (via drill 0.3)
  Top 0.305: v3.43,32.8 3.43,37.15 5.83,39.55 5.83,42.41 v12.34,48.92 | JP5.5 33.72,47.66 38.29,43.09 v39.43,43.09 39.43,42.98 v44.81,37.6
  Bottom 0.305: ICSP1.3 45.26,7.43 46.29,8.46 46.29,10.17 48.35,12.23 48.35,23.55 44.92,26.98 44.92,31.43 RF1.SCK 44.81,31.55 v44.81,37.6 | v3.43,32.8 3.43,28.69 4.8,27.32 5.49,27.32 U1.17 | v12.34,48.92 32.35,48.92 33.6,47.66 JP5.5 | v39.43,43.09 40.8,41.72 RF2.SCK
GND  (via drill 0.3)  (1 unrouted)
  Top 0.381: v12.12,6.51 12.12,6.29 8.34,2.52 8.34,1.94 JP3.14 | v10.63,33.38 10.63,31.89 9.26,30.52 v9.26,29.15 | v4.57,25.38 6.17,25.38 7.66,26.86 v7.66,27.55 | v4.34,5.83 4,5.83 1.37,8.46 1.37,28.69 1.71,29.03 CN4.1 | v38.18,7.2 42.18,11.2 46.29,11.2 | 46.29,11.2 46.41,11.2 47.66,9.94 ICSP1.6 | v27.77,44.81 31.77,44.81 v33.03,43.55 36.23,43.55 39.2,40.58 v39.43,40.58 46.29,33.72 46.29,11.2 | v24.46,22.17 v16.46,22.17
  Bottom 0.381: v12.12,6.51 14.74,6.51 U5.1 | C5.2 16.46,34.75 14.06,34.75 C4.2 13.83,34.75 11.54,34.75 C3.2 11.43,34.63 10.63,34.63 | 10.63,34.63 8.91,34.63 C2.2 | 14.29,22.29 13.83,22.29 13.37,22.75 U1.5 | 14.97,22.97 14.29,22.29 | 14.97,22.97 14.97,23.43 14.52,23.89 U1.3 14.29,24 11.89,26.4 10.86,26.4 8.69,28.57 | 8.69,28.57 7.89,29.38 U1.21 | X1.2 15.09,19.89 15.09,20.34 14.4,21.03 14.4,22.17 14.29,22.29 | v10.63,33.38 10.63,34.63 | 8.69,28.57 v9.26,29.15 | v4.57,25.38 1.83,28.12 1.83,29.03 CN4.1 | 8.69,28.57 v7.66,27.55 | v4.34,5.83 8.23,1.94 JP3.14 | v38.18,7.2 SJ3.1 | v27.77,44.81 27.32,45.26 11.09,45.26 8.91,43.09 8.91,42.86 R2.1 | v33.03,43.55 34.86,41.72 RF2.GND 34.86,41.49 33.72,40.35 33.72,31.43 24.8,22.52 24.8,22.17 | v39.43,40.58 39.43,38.18 38.98,37.72 38.98,31.55 RF1.GND | 24.8,22.17 24.8,17.37 U4.C | v16.46,22.17 15.77,22.86 15.09,22.86 14.97,22.97 | 24.8,22.17 v24.46,22.17
LED-B
  Bottom 0.305: R5.1 16.46,41.03 16.46,40.35 15.54,39.43 15.54,38.86 19.55,34.86 19.55,31.2 20.23,30.52 25.6,30.52 26.75,31.66 U4.BL
LED-G  (via drill 0.3)
  Top 0.305: v15.2,41.03 15.43,41.03 16.69,39.78 v16.8,39.78
  Bottom 0.305: v15.2,41.03 14.06,41.03 R4.1 | v16.8,39.78 16.8,39.55 21.03,35.32 21.03,33.49 22.75,31.77 U4.G
LED-MID-1
  Top 0.305: L6.4-DIN 37.72,17.72 43.09,23.09 43.09,25.15 44.35,26.4 L5.2-DOUT
LED-MID-2  (1 unrouted)
LED-MID-3
  Top 0.305: L9.2-DOUT 26.4,5.37 24.92,5.37 21.03,9.26 20.23,9.26 17.6,11.89 L10.4-DIN
LED-OUT-1
  Top 0.305: L2.4-DIN 31.77,37.72 29.83,39.66 29.83,39.78 28.57,41.03 26.18,41.03 23.09,44.12 L1.2-DOUT
LED-OUT-2
  Top 0.305: L3.2-DOUT 37.49,39.66 37.49,34.52 39.43,32.58 39.43,29.26 38.98,28.8 L4.4-DIN
LED-OUT-3
  Top 0.305: L5.4-DIN 39.55,23.2 39.55,24.69 42.18,27.32 42.18,30.52 42.06,30.63 42.06,33.6 L4.2-DOUT
LED-OUT-4
  Top 0.305: L12.2-DOUT 7.43,15.89 7.43,17.26 9.03,18.86 9.03,25.26 10.17,26.4 L13.4-DIN
LED-OUT-5
  Top 0.305: L13.2-DOUT 5.37,23.2 6.06,23.2 9.03,26.18 9.03,26.98 9.6,27.55 11.32,27.55 12,28.23 12,31.77 L14.4-DIN
LED-OUT-6  (1 unrouted)
LED-R  (via drill 0.3)
  Top 0.305: v15.2,40.01 15.43,40.01 v16.23,39.2
  Bottom 0.305: v15.2,40.01 13.14,40.01 12.12,41.03 11.43,41.03 R3.1 | v16.23,39.2 16.23,38.86 20.57,34.52 20.57,31.89 20.69,31.77 U4.R
LED_DATA  (via drill 0.3)
  Top 0.305: v20.46,41.03 24.8,41.03 26.4,39.43 L1.4-DIN
  Bottom 0.305: v20.46,41.03 19.09,41.03 R6.2
LED_NEG  (via drill 0.3)  (1 unrouted)
  Top 0.381: 23.77,38.75 23.2,39.32 L1.3-GND | 23.77,38.75 25.26,37.26 | 25.26,37.26 25.6,36.92 25.6,36.46 C8.2 | 14.29,32.92 14.29,30.06 C21.2 | 14.29,32.92 13.37,33.83 L15.3-GND | 14.29,32.92 14.97,33.6 17.03,33.6 C22.2 17.26,33.72 17.6,34.06 17.6,37.49 L16.3-GND 17.72,37.6 18.86,37.6 20.57,35.89 21.03,35.89 C23.2 21.03,36.01 23.77,38.75 | 37.03,24 36.46,24 C12.2 | 38.63,25.6 39.43,26.4 L5.3-GND | 38.63,25.6 37.03,24 | 38.63,25.6 35.89,28.35 C11.2 35.89,28.57 35.89,29.03 36.46,29.6 36.46,31.89 | 37.03,24 37.15,23.89 37.15,23.55 38.86,21.83 38.86,20.8 L6.3-GND 38.75,20.69 37.15,20.69 36.01,19.55 35.43,19.55 C13.2 35.2,19.43 35.2,15.89 | 33.72,35.32 33.72,36.12 33.83,36.23 L3.3-GND | 33.72,35.32 33.72,32.46 C10.2 33.83,32.35 34.29,31.89 36.46,31.89 | 33.72,35.32 30.06,35.32 C9.2 29.95,35.43 29.95,36.01 28.8,37.15 28.8,37.38 | 36.46,31.89 37.6,31.89 L4.3-GND | 28.8,37.38 28.8,38.86 L2.3-GND | v25.49,37.49 25.26,37.26 | v28.69,37.38 28.8,37.38 | C19.2 13.72,21.03 14.4,21.03 15.43,20 15.43,18.75 15.89,18.29 15.89,17.14 C18.2 16,17.49 v17.03,17.49 | L12.3-GND 12,17.72 12,19.32 13.6,20.92 C19.2 | 12.69,25.6 13.03,25.6 C20.2 | 10.86,23.77 10.29,23.2 L13.3-GND | 10.86,23.77 12.69,25.6 | v11.09,29.72 10.74,29.38 10.74,28.8 L14.3-GND | v12.57,26.86 12.57,25.72 12.69,25.6 | 10.86,23.77 13.49,21.14 C19.2 | 21.37,11.77 20.8,11.2 20.8,10.74 L10.3-GND | 21.37,11.77 22.63,13.03 23.89,13.03 C16.2 23.89,12.92 v23.89,11.43 | 21.37,11.77 19.66,13.49 | 19.66,13.49 19.55,13.6 19.55,14.29 C17.2 | 17.03,13.37 19.55,13.37 19.66,13.49 | 17.03,13.37 15.66,13.37 L11.3-GND | C15.2 28.46,13.6 29.03,13.6 30.63,12 31.77,12 L8.3-GND
  Top 0.381: 35.2,15.89 36.01,15.89 36.23,15.66 L7.3-GND | 35.2,15.89 32.46,15.89 C14.2 32.35,15.77 31.89,15.32 31.89,12.12 L8.3-GND | v31.89,10.52 31.89,11.77 L8.3-GND | v17.03,13.49 17.03,13.37
  Bottom 0.381: v25.49,37.49 26.98,37.49 27.09,37.38 v28.69,37.38 | v11.09,29.72 11.09,28.35 v12.57,26.86 | 31.89,5.71 29.26,5.71 28.8,6.17 C24.C 28.69,6.4 23.89,11.2 v23.89,11.43 | 31.89,5.71 SJ3.2 | v31.89,10.52 31.89,5.71 | v17.03,13.49 v17.03,17.49
LED_POS  (via drill 0.3)
  Top 0.381: v9.72,17.14 9.72,12.23 L11.1-VDD | v8,18.86 6.17,18.86 L12.1-VDD 6.06,18.97 3.77,21.26 3.77,25.72 4.46,26.4 5.26,26.4 L13.1-VDD 5.37,26.52 v5.37,29.83 | v7.32,32 7.32,33.6 L14.1-VDD 7.43,33.83 v7.43,36.58 | v10.63,38.18 12.12,39.66 L15.1-VDD | v12.8,11.89 15.77,8.91 15.77,7.54 L10.1-VDD 15.77,7.32 18.4,4.69 19.2,4.69 19.77,5.26 23.09,5.26 L9.1-VDD 23.2,5.14 24.12,5.14 v24.23,5.03 | 33.72,18.52 33.72,19.66 35.09,21.03 35.78,21.03 C13.1 35.43,21.14 35.43,24.69 36.35,25.6 C12.1 36.23,25.72 36.23,26.4 34.75,27.89 34.75,29.95 C11.1 35.2,30.06 34.63,30.06 32.46,32.23 32.46,33.6 C10.1 32.23,33.6 29.95,33.6 28.46,35.09 28.46,35.78 C9.1 28.23,35.89 v27.55,36.58 | 33.72,18.52 33.72,17.14 C14.1 | 20.46,43.43 18.97,43.43 L16.1-VDD | 20.46,43.43 22.52,45.49 25.15,45.49 L1.1-VDD | 14.06,28 14.06,24.92 13.14,24 C20.1 | 14.06,28 13.72,28.35 C21.1 | 14.06,28 15.89,29.83 15.89,32.35 C22.1 16,32.46 17.37,32.46 19.43,34.52 19.43,35.2 C23.1 19.55,34.75 21.6,34.75 23.09,36.23 | 23.09,36.23 23.2,36.35 23.89,36.35 C8.1 | v20.57,42.06 20.57,43.32 20.46,43.43 | 23.09,36.23 v22.75,36.58 | C19.1 14.4,19.43 14.4,17.26 15.77,15.89 17.03,15.89 C18.1 17.26,16 18.75,16 21.37,18.63 27.89,18.63 28.69,17.83 28.69,14.86 | C17.1 21.14,13.72 21.49,14.06 24.69,14.06 25.6,13.14 C16.1 25.72,13.26 27.32,14.86 28.69,14.86 | 28.69,14.86 v28.8,14.86 28.92,14.86 29.38,14.4 29.95,14.4 C15.1 | 37.49,10.74 37.49,9.94 L7.1-VDD 37.38,9.72 37.38,9.14 34.18,5.94 33.6,5.94 33.49,6.06 30.75,6.06 L8.1-VDD 30.52,6.17 29.95,6.74 v24.57,6.74 | 37.49,10.74 37.49,11.66 41.6,15.77 42.06,15.77 L6.1-VDD 42.29,15.77 44.81,18.29 44.81,19.2 44.46,19.55 44.46,23.09 L5.1-VDD 44.58,23.2 45.61,24.23 45.61,27.09 43.43,29.26 43.43,30.63 L4.1-VDD 43.55,30.75 43.55,34.29 40.46,37.38 39.78,37.38 L3.1-VDD 39.66,37.49 39.66,39.2 36.8,42.06 33.72,42.06 L2.1-VDD
  Top 0.381: 37.49,10.74 v37.95,10.74 | v33.6,18.52 33.72,18.52
  Bottom 0.381: v8,18.86 v9.72,17.14 12.8,14.06 v12.8,11.89 | v7.32,32 7.32,31.77 v5.37,29.83 | v10.63,38.18 9.03,38.18 v7.43,36.58 | v20.57,42.06 22.75,39.89 v22.75,36.58 v27.55,36.58 | 37.26,10.74 37.26,11.77 37.15,11.89 SJ2.2 37.03,12 29.26,12 28.8,12.46 C24.A 28.8,12.69 v28.8,14.86 28.8,14.97 32.46,18.63 33.15,18.63 33.26,18.52 v33.6,18.52 | 37.26,10.74 37.26,8.8 SJ1.2 | v37.95,10.74 37.26,10.74 | v24.23,5.03 24.23,6.4 v24.57,6.74
N$1
  Top 0.305: L2.2-DOUT 30.75,43.32 30.75,41.83 36.23,36.35 36.23,33.95 L3.4-DIN
N$2
  Top 0.305: L7.4-DIN 33.95,13.37 37.83,13.37 43.32,18.86 L6.2-DOUT
N$3
  Top 0.305: L8.2-DOUT 33.6,7.43 25.49,7.43 23.2,9.72 23.2,10.17 L9.4-DIN
N$4
  Top 0.305: L11.4-DIN 13.26,15.54 13.26,12.46 18.86,6.86 18.86,6.17 L10.2-DOUT
N$5  (via drill 0.3)
  Top 0.305: v11.43,20 10.74,20.69 L12.4-DIN | v12.12,16.57 12.12,15.54 12,15.43 12,9.94 12.12,9.83 L11.2-DOUT
  Bottom 0.305: v11.43,20 11.43,17.26 v12.12,16.57
N$6
  Bottom 0.305: U1.7 12.23,21.6 12.23,21.37 14.17,19.43 14.17,18.97 X1.1
N$8
  Bottom 0.305: RF1.ANT 34.98,31.55 34.98,39.43 36.8,41.26 36.8,41.6 RF2.ANA 37.03,41.72 39.55,44.23 42.75,44.23 U$1.P$1
N$18  (via drill 0.3)
  Top 0.305: v7.32,38.41 5.6,36.69 5.6,32 6.06,31.55 6.06,30.75 L14.2-DOUT | v14.52,37.38 15.54,36.35 L15.4-DIN
  Bottom 0.305: v7.32,38.41 8.34,38.41 8.91,38.98 12.92,38.98 v14.52,37.38
N$20  (via drill 0.3)
  Top 0.305: v3.2,37.83 3.2,40.35 1.83,41.72 CN4.6
  Bottom 0.305: v3.2,37.83 6.29,34.75 C1.2
N$21  (via drill 0.3)
  Top 0.305: v14.97,15.54 v13.6,16.92
  Bottom 0.305: v13.6,16.92 13.03,17.49 13.03,19.32 11.66,20.69 11.66,21.14 U1.8 | v14.97,15.54 14.97,16.46 17.14,18.63 17.14,19.43 16,20.57 X1.3
RST  (via drill 0.3)
  Top 0.305: v27.89,22.86 v25.95,24.8 | v6.51,39.89 6.51,42.18 13.26,48.92 42.41,48.92 44.35,46.98 44.35,45.49 48.92,40.92 48.92,8.57 47.78,7.43 ICSP1.5
  Bottom 0.305: 6.4,39.89 6.4,41.03 R1.2 | 6.4,39.89 6.4,36.46 C1.1 | v25.95,24.8 22.86,24.8 18.29,29.38 14.63,29.38 14.17,28.92 13.95,28.92 U1.29 | v27.89,22.86 30.98,19.77 34.06,19.77 41.6,12.23 41.6,9.37 42.52,8.46 43.09,8.46 44.12,7.43 44.12,6.86 44.69,6.29 46.63,6.29 47.66,7.32 ICSP1.5 | v6.51,39.89 6.4,39.89
VBUS  (via drill 0.3)  (1 unrouted)
  Top 0.381: v10.52,10.97 10.52,9.49 12.92,7.09 12.92,6.17 10.86,4.12 10.86,1.94 JP3.13 | v4.34,28.8 4.34,27.32 2.74,25.72 2.74,9.37 5.37,6.74 v5.37,5.94
  Bottom 0.381: 4.34,33.6 2.29,33.6 1.83,34.06 CN4.3 | 4.34,33.6 6.97,33.6 7.32,33.95 7.32,34.86 8.8,36.35 C2.1 | 10.52,11.09 9.49,11.09 9.14,10.74 7.89,10.74 CN1.VBUS | 10.52,11.09 14.74,11.09 U5.3 | v10.52,10.97 10.52,11.09 | v4.34,28.8 4.34,33.6 | v5.37,5.94 5.71,5.94 8.34,3.31 9.49,3.31 10.86,1.94 JP3.13
VCC  (via drill 0.3)  (1 unrouted)
  Top 0.305: v38.75,9.94 38.75,8.8 37.38,7.43 37.38,6.97 37.95,6.4 39.2,6.4 42.63,9.83 ICSP1.2 | v7.66,41.72 11.43,41.72 13.49,39.66 13.49,38.18 v13.14,37.83 | v11.32,10.29 11.32,16.34 10.52,17.14 v10.52,19.66 | v12.34,35.55 12.34,34.75 12,34.4 12,33.26 13.14,32.12 13.14,29.49 12.46,28.8 12.46,27.77 11.32,26.63 v11.32,25.6 | v29.49,22.17 26.86,22.17 24.8,20.12 19.32,20.12 18.06,18.86 v16.46,18.86
  Bottom 0.305: v38.75,9.94 38.18,9.37 38.18,8.8 SJ1.1 | RF2.VDD 34.98,22.17 34.98,28.8 36.8,30.63 36.8,31.43 RF1.VDD | ICSP1.2 42.63,9.94 42.63,14.4 34.98,22.06 RF2.VDD | 12.34,36.46 11.43,36.46 C3.1 | 12.34,36.46 13.14,36.46 | 13.14,36.46 13.95,36.46 C4.1 | v7.66,41.72 6.63,42.75 6.4,42.75 R1.1 | 13.14,36.46 v13.14,37.83 | 12.23,22.75 12.69,22.29 U1.6 | 12.23,23.32 12.23,22.75 | 12.23,23.32 12.8,23.89 13.37,23.89 13.83,23.43 U1.4 | 10.57,24.86 12.12,23.32 12.23,23.32 | 10.57,24.86 9.03,26.4 7.77,26.4 6.4,27.77 6.17,27.77 U1.18 | v11.32,10.29 12.8,8.8 14.74,8.8 U5.2 14.86,8.8 16.23,10.17 16.23,13.37 14.29,15.32 14.29,16.46 16.46,18.63 v16.46,18.86 | v10.52,19.66 10.52,21.49 11.77,22.75 12.23,22.75 | v12.34,35.55 12.34,36.46 | 10.57,24.86 v11.32,25.6 | v29.49,22.17 34.75,22.17 RF2.VDD

### Text on the board
tNames: LED Dial Shield / Richard Hawthorn / richardhawthorn.com | A2 | A3 | A4 | A5 | 13 | 12 | 11 | 10 | SDA | SCL | SK | MI | MO | SS | GRN | BLK | ANT | RH008.1 / Feb 2015 | RX | TX | ~ | ~ | ~ | ~ | GND | VIN | 3.3 | 0 | 1 | 2 | 3 | 4 | 5 | 6 | 7 | 8 | 9 | A1
bNames: 5V | 3.3V | GND
tDocu: REG